# Altium schematic sheet PMIC_RK808.SchDoc
size A3; SheetNumber: 7; SheetTotal: 7
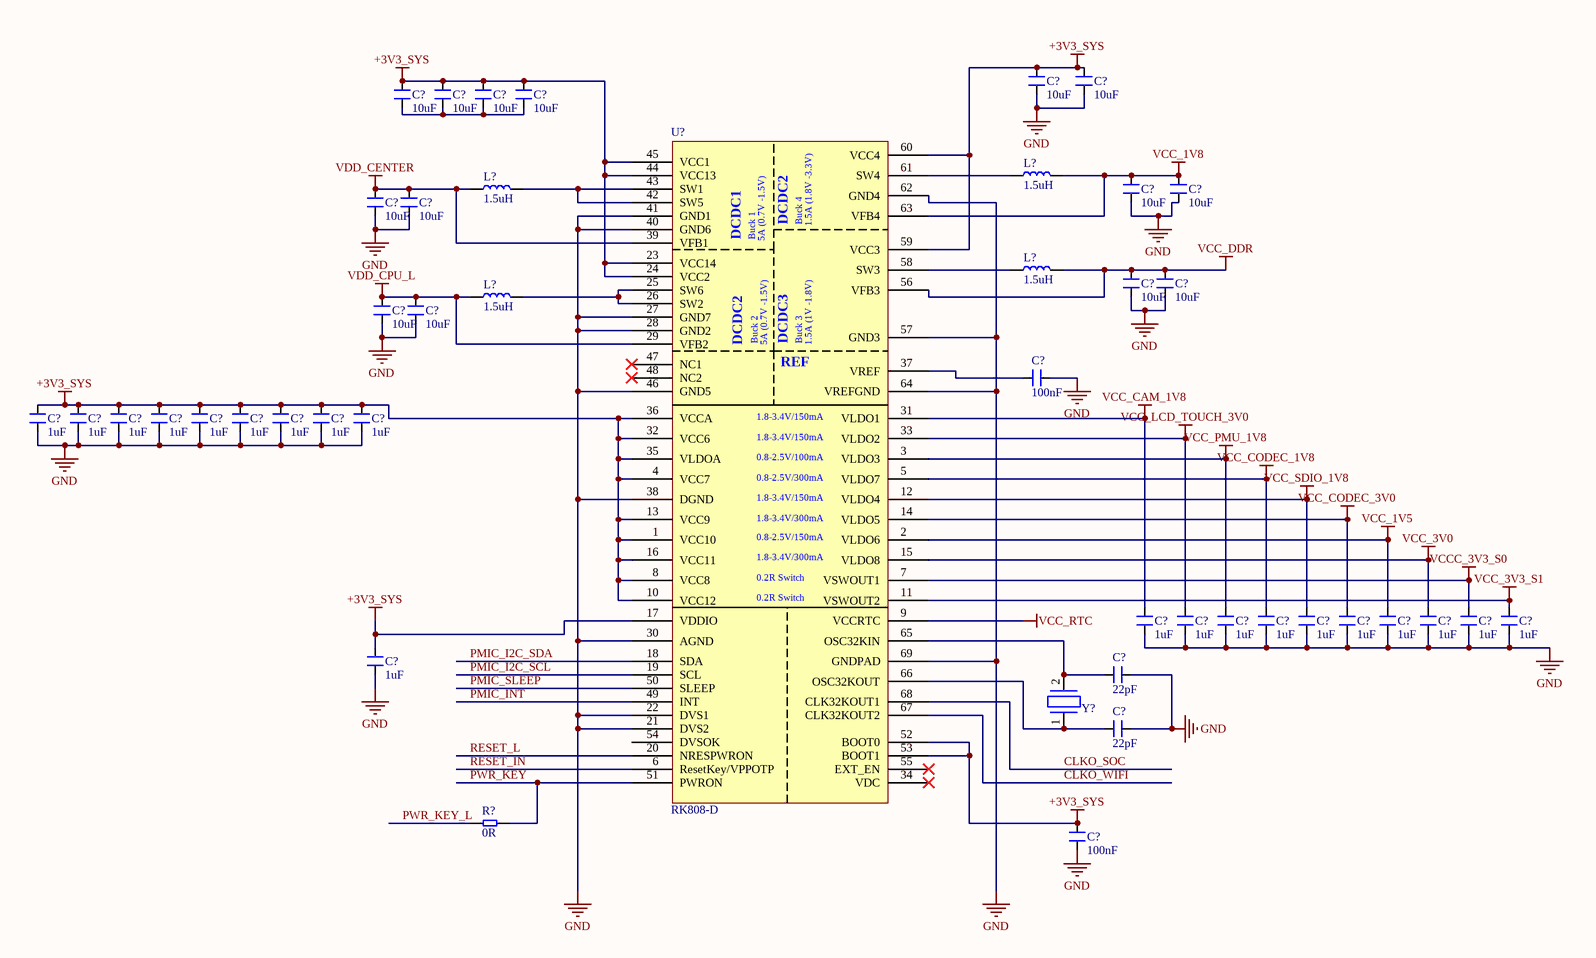
[diagram p0: PMIC_RK808.SchDoc]

## Parts
(Parts that share a designator on the sheet are numbered #1, #2 ... from top to bottom, then left to right.)
C?#1  10uF  [CAP_0402]
C?#2  10uF  [CAP_0402]
C?#3  10uF  [CAP_0402]
C?#4  10uF  [CAP_0402]
C?#5  10uF  [CAP_0402]
C?#6  10uF  [CAP_0402]
C?#7  10uF  [CAP_0402]
C?#8  10uF  [CAP_0402]
C?#9  10uF  [CAP_0402]
C?#10  10uF  [CAP_0402]
C?#11  10uF  [CAP_0402]
C?#12  10uF  [CAP_0402]
C?#13  10uF  [CAP_0402]
C?#14  10uF  [CAP_0402]
C?#15  100nF  [CAP_0201]
C?#16  1uF  [CAP_0201]
C?#17  1uF  [CAP_0201]
C?#18  1uF  [CAP_0201]
C?#19  1uF  [CAP_0201]
C?#20  1uF  [CAP_0201]
C?#21  1uF  [CAP_0201]
C?#22  1uF  [CAP_0201]
C?#23  1uF  [CAP_0201]
C?#24  1uF  [CAP_0201]
C?#25  1uF  [CAP_0201]
C?#26  1uF  [CAP_0201]
C?#27  1uF  [CAP_0201]
C?#28  1uF  [CAP_0201]
C?#29  1uF  [CAP_0201]
C?#30  1uF  [CAP_0201]
C?#31  1uF  [CAP_0201]
C?#32  1uF  [CAP_0201]
C?#33  1uF  [CAP_0201]
C?#34  1uF  [CAP_0201]
C?#35  1uF  [CAP_0201]
C?#36  22pF  [CAP_0201]
C?#37  22pF  [CAP_0201]
C?#38  100nF  [CAP_0201]
L?#1  1.5uH
L?#2  1.5uH
L?#3  1.5uH
L?#4  1.5uH
R?  0R  [RES_0201]
U?  RK808-D  [QFN68_13.7_220.4X220.4_SMD]
Y?  32KHz  (value not drawn)

## Nets
+3V3_SYS: C?#1.2 C?#2.2 C?#3.2 C?#4.2 C?#5.2 C?#6.2 C?#16.2 C?#17.2 C?#18.2 C?#19.2 C?#20.2 C?#21.2 C?#22.2 C?#23.2 C?#24.2 C?#35.2 C?#38.2 U?.1(VCC10) U?.4(VCC7) U?.8(VCC8) U?.10(VCC12) U?.13(VCC9) U?.16(VCC11) U?.17(VDDIO) U?.23(VCC14) U?.24(VCC2) U?.32(VCC6) U?.35(VLDOA) U?.36(VCCA) U?.44(VCC13) U?.45(VCC1) U?.52(BOOT0) U?.53(BOOT1) U?.59(VCC3) U?.60(VCC4)
GND: C?#1.1 C?#2.1 C?#7.1 C?#8.1 C?#9.1 C?#10.1 C?#11.1 C?#12.1 C?#13.1 C?#14.1 C?#15.1 C?#16.1 C?#17.1 C?#18.1 C?#19.1 C?#20.1 C?#21.1 C?#22.1 C?#23.1 C?#24.1 C?#25.1 C?#26.1 C?#27.1 C?#28.1 C?#29.1 C?#30.1 C?#31.1 C?#32.1 C?#33.1 C?#34.1 C?#35.1 C?#36.1 C?#37.1 C?#38.1 U?.21(DVS2) U?.22(DVS1) U?.27(GND7) U?.28(GND2) U?.30(AGND) U?.38(DGND) U?.40(GND6) U?.41(GND1) U?.46(GND5) U?.57(GND3) U?.62(GND4) U?.64(VREFGND) U?.69(GNDPAD)
VCC_1V5: C?#31.2 U?.2(VLDO6)
VCC_1V8: C?#7.2 C?#8.2 L?#1.2 U?.63(VFB4)
VCC_3V0: C?#32.2 U?.15(VLDO8)
VCC_3V3_S1: C?#34.2 U?.11(VSWOUT2)
VCC_CAM_1V8: C?#25.2 U?.31(VLDO1)
VCC_CODEC_1V8: C?#28.2 U?.5(VLDO7)
VCC_CODEC_3V0: C?#30.2 U?.14(VLDO5)
VCC_DDR: C?#11.2 C?#12.2 L?#3.2 U?.56(VFB3)
VCC_LCD_TOUCH_3V0: C?#26.2 U?.33(VLDO2)
VCC_PMU_1V8: C?#27.2 U?.3(VLDO3)
VCC_RTC: U?.9(VCCRTC)
VCC_SDIO_1V8: C?#29.2 U?.12(VLDO4)
VCCC_3V3_S0: C?#33.2 U?.7(VSWOUT1)
VDD_CENTER: C?#9.2 C?#10.2 L?#2.1 U?.39(VFB1)
VDD_CPU_L: C?#13.2 C?#14.2 L?#4.1 U?.29(VFB2)
CLKO_SOC: U?.68(CLK32KOUT1)
CLKO_WIFI: U?.67(CLK32KOUT2)
PMIC_I2C_SCL: U?.19(SCL)
PMIC_I2C_SDA: U?.18(SDA)
PMIC_INT: U?.49(INT)
PMIC_SLEEP: U?.50(SLEEP)
PWR_KEY: R?.2 U?.51(PWRON)
PWR_KEY_L: R?.1
RESET_IN: U?.6(ResetKey/VPPOTP)
RESET_L: U?.20(NRESPWRON)
NetC?#3_1: C?#3.1 C?#4.1 C?#5.1 C?#6.1
NetC?#15_2: C?#15.2 U?.37(VREF)
NetC?#36_2: C?#36.2 U?.65(OSC32KIN) Y?.2
NetC?#37_2: C?#37.2 U?.66(OSC32KOUT) Y?.1
NetL?#1_1: L?#1.1 U?.61(SW4)
NetL?#2_2: L?#2.2 U?.42(SW5) U?.43(SW1)
NetL?#3_1: L?#3.1 U?.58(SW3)
NetL?#4_2: L?#4.2 U?.25(SW6) U?.26(SW2)

Not connected (* = marked no-connect by the designer): U? 34(VDC)* 47(NC1)* 48(NC2)* 54(DVSOK) 55(EXT_EN)*

## Notes on the sheet
- (in symbol IC_RK808-D-QFN68) DCDC2; Buck 4; 1.5A (1.8V -3.3V); DCDC1; Buck 1; 5A (0.7V -1.5V); Buck 2; DCDC3; Buck 3; 1.5A (1V -1.8V); REF; 1.8-3.4V/150mA; 0.8-2.5V/100mA; 0.8-2.5V/300mA; 1.8-3.4V/300mA; 0.8-2.5V/150mA; 0.2R Switch

## Library data of the parts
C?#1-C?#14 = CAP_10uF-10V-20%-0402: Multilayer Ceramic Capacitor, 10 uF, 10 V, ± 20%, X5R, 0402 [1005 Metric]; Manufacturer Part Number: CL05A106MP5NUNC; Manufacturer: Samsung Electro-Mechanics; Manufacturer 1: Samsung; Voltage Rating: 10V; Case/Package: 0402; Supplier-1: Digikey; Supplier 1: Digi-Key; Manufacturer Part Number 1: CL05A106MP5NUNC; RoHS: Yes; Category: Ceramic Capacitors; Stock 1: 2175928; Pricing 1: 1=0.18, 10=0.121, 50=0.0726, 100=0.0613, 500=0.04192, 1000=0.03708, 2500=0.03546, 5000=0.03224 (USD); Mount: Surface Mount; Case Code (Metric): 1005; Case Code (Imperial): 0402; Min Operating Temperature: -55°C; Max Operating Temperature: 85°C; Package Quantity: 1; Packaging: Tape and Reel; Capacitance: 10uF; Tolerance: 20%; Dielectric: X5R; Series: CL; Length: 1mm; Width: 0.02inch; Thickness: 0.028inch; Depth: 0.5mm; Radiation Hardening: No; Lead Free: Lead Free; RoHS Compliant: Yes; ComponentLink1URL: https://datasheet.ciiva.com/25721/cl05a106mp5nunc-25721584.pdf?src-supplier=Digi-Key; ComponentLink1Description: https://datasheet.ciiva.com/25721/cl05a106mp5nunc-25721584.pdf?src-supplier=Digi-Key; ComponentLink2URL: https://datasheet.ciiva.com/26838/getdatasheetpartid-745310-26838170.pdf?src-supplier=Verical; ComponentLink2Description: https://datasheet.ciiva.com/26838/getdatasheetpartid-745310-26838170.pdf?src-supplier=Verical; Supplier Part Number 1: 1276-1450-1-ND
C?#15 C?#38 = CAP_100nF-25V-10%-0201: Multilayer Ceramic Capacitor, 0.1 uF, 25 V, ± 10%, X5R, 0201 [0603 Metric]; Manufacturer: TDK Corporation; Manufacturer Part Number: C0603X5R1E104K030BB; Manufacturer 1: TDK; Voltage Rating: 25V; Case/Package: 0201; Supplier-1: Digikey; Supplier 1: Digi-Key; Manufacturer Part Number 1: C0603X5R1E104K030BB; RoHS: Yes; Category: Ceramic Capacitors; Stock 1: 525939; Pricing 1: 1=0.1, 10=0.069, 50=0.0376, 100=0.0307, 500=0.02192, 1000=0.01722, 2500=0.01566, 5000=0.0144 (USD); Mount: Surface Mount; Case Code (Metric): 0603; Case Code (Imperial): 0201; Weight: 6E-06oz; Dielectric Material: Ceramic; Min Operating Temperature: -55°C; Max Operating Temperature: 85°C; Package Quantity: 15000; Packaging: Tape and Reel; Capacitance: 100nF; Tolerance: 10%; Dielectric: X5R; Termination: SMD/SMT; Voltage Rating (DC): 25V; Series: C; Length: 0.6mm; Width: 0.3mm; Height: 0.3mm; Depth: 0.3mm; Reach SVHC Compliant: No; Lead Free: Lead Free; RoHS Compliant: Yes; ComponentLink1URL: https://datasheet.ciiva.com/14915/tdkmlcccaprange-14915358.pdf?src-supplier=Digi-Key; ComponentLink1Description: https://datasheet.ciiva.com/14915/tdkmlcccaprange-14915358.pdf?src-supplier=Digi-Key; Supplier Part Number 1: 445-13671-1-ND
C?#16-C?#35 = CAP_1uF-16V-10%-0201: Multilayer Ceramic Capacitor, 1 uF, 16 V, ± 20%, X5R, 0201 [0603 Metric]; Manufacturer: Samsung Electro-Mechanics; Manufacturer Part Number: CL03A105MO3NRNH; Manufacturer 1: Samsung; Case/Package: 0201; Supplier-1: Digikey; Supplier 1: Digi-Key; Manufacturer Part Number 1: CL03A105MO3NRNH; RoHS: Yes; Category: Ceramic Capacitors; Stock 1: 1186098; Pricing 1: 1=0.25, 10=0.17, 50=0.1018, 100=0.086, 500=0.05882, 1000=0.05204, 2500=0.04977, 5000=0.04525 (USD); ComponentLink1URL: https://datasheet.octopart.com/CL03A105MO3NRNH-Samsung-Electro-Mechanics-datasheet-136037157.pdf?src-supplier=Future+Electronics; ComponentLink1Description: https://datasheet.octopart.com/CL03A105MO3NRNH-Samsung-Electro-Mechanics-datasheet-136037157.pdf?src-supplier=Future+Electronics; ComponentLink2URL: http://www.samsungsem.com/kr/support/product-search/mlcc/CL03A105MO3NRNH.jsp?src-supplier=Digi-Key; ComponentLink2Description: http://www.samsungsem.com/kr/support/product-search/mlcc/CL03A105MO3NRNH.jsp?src-supplier=Digi-Key
C?#36 C?#37 = CAP_22pF-25V-10%-0201: Cap Ceramic 22pF 25V C0G 10% SMD 0201 125C Paper T/R; Manufacturer: Johanson Technology Inc.; Manufacturer Part Number: 250R05L220KV4T; Manufacturer 1: Johanson; Case/Package: 0201; Supplier-1: Digikey; Supplier 1: Mouser; Manufacturer Part Number 1: 250R05L220KV4T; RoHS: Yes; Category: Ceramic Capacitors; Pricing 1: 1=0.11, 10=0.081, 50=0.081, 100=0.037, 1000=0.021, 10000=0.015 (USD); Mount: Surface Mount; Case Code (Imperial): 0201; Case Code (Metric): 0603; Weight: 6E-06oz; Min Operating Temperature: -55°C; Max Operating Temperature: 125°C; Voltage Rating: 25V; Capacitance: 22pF; Voltage Rating (DC): 25V; Tolerance: 10%; Packaging: Tape and Reel; Package Quantity: 15000; Dielectric: C0G; Termination: SMD/SMT; Series: L; Length: 0.6mm; Width: 0.3mm; Height: 0.3mm; Depth: 0.3mm; RoHS Compliant: Yes; ComponentLink1URL: http://www.mouser.com/ds/2/611/JTI-CAT-MLCC-HighQ-516212.pdf?src-supplier=Mouser; ComponentLink1Description: http://www.mouser.com/ds/2/611/JTI-CAT-MLCC-HighQ-516212.pdf?src-supplier=Mouser; ComponentLink2URL: https://www.johansontechnology.com/downloads/JTI-CAT-MLCC-HighQ.pdf?src-supplier=Digi-Key; ComponentLink2Description: https://www.johansontechnology.com/downloads/JTI-CAT-MLCC-HighQ.pdf?src-supplier=Digi-Key; ComponentLink3URL: http://components.arrow.com/part/dataview/43745096S9156427N2069?src-supplier=Arrow+Electronics; ComponentLink3Description: http://components.arrow.com/part/dataview/43745096S9156427N2069?src-supplier=Arrow+Electronics; Supplier Part Number 1: 609-250R05L220KV4T
L?#1-L?#4 = IND_1.5uH-6A-20%-SMD: WPN4020H1R5MT / Wire Wound SMD Power Inductors – WPN Series / Operating Temp. : -40℃~+125℃ (Including self-heating) /; Manufacturer: Sunlord; Mnaufcaturer Part Number: WPN4020H1R5MT; Case/Package: SMD; Supplier-1: NA
R? = RES_0R-0.05W-1%-0201: 0 Ohms Jumper 0.05W, 1/20W Chip Resistor 0201 (0603 Metric) Automotive AEC-Q200 Thick Film; Manufacturer: Bourns Inc.; Manufacturer Part Number: CR0201AJ/-000GLF; Case/Package: 0201; Supplier-1: Digikey
U? = IC_RK808-D-QFN68: The RK808 is a complete power supply solution for Portable systems.; Manufacturer: Rockchip; Manufacturer Part Number: RK808-D; Case/Package: QFN68; Supplier-1: Rockchip
Y? = XTAL_32MHz_ABS07-32.768KHZ-T: Crystal 0.032768MHz ±20ppm (Tol) 12.5pF Flexural 70000Ohm 2-Pin CSMD T/R; Manufacturer: Abracon; ESR (Equivalent Series Resistance): 70kR; Supplier 1: Future Electronics; Manufacturer Part Number: ABS07-32.768KHZ-T; RoHS: Yes; Category: Crystals; Stock 1: 461; Pricing 1: 1=0.675, 15=0.585, 75=0.53, 300=0.48, 1500=0.425 (USD); Case/Package: CSMD; Number of Pins: 2; Min Operating Temperature: -40°C; Max Operating Temperature: 85°C; Frequency Tolerance: 20ppm; Load Capacitance: 12.5pF; Frequency: 32.768kHz; Packaging: Tape and Reel; Series: ABS07; Operating Frequency: 32.768 kHz; Package Quantity: 3000; Tolerance: 20ppm; Termination: SMD/SMT; Series Resistance: 70kR; Length: 3.2mm; Width: 1.5mm; Height: 0.9mm; Depth: 1.5mm; Radiation Hardening: No; Lead Free: Lead Free; RoHS Compliant: Yes; Reach SVHC Compliant: No; ComponentLink1URL: https://datasheet.ciiva.com/7998/1912628-7998667.pdf?src-supplier=Element14; ComponentLink1Description: https://datasheet.ciiva.com/7998/1912628-7998667.pdf?src-supplier=Element14; ComponentLink2URL: https://datasheet.ciiva.com/1357/1883680-1357319.pdf?src-supplier=Element14; ComponentLink2Description: https://datasheet.ciiva.com/1357/1883680-1357319.pdf?src-supplier=Element14; ComponentLink3URL: https://datasheet.ciiva.com/854/abs07-854936.pdf?src-supplier=Digi-Key; ComponentLink3Description: https://datasheet.ciiva.com/854/abs07-854936.pdf?src-supplier=Digi-Key; ComponentLink4URL: https://datasheet.ciiva.com/854/abs07-854935.pdf?src-supplier=Digi-Key; ComponentLink4Description: https://datasheet.ciiva.com/854/abs07-854935.pdf?src-supplier=Digi-Key; ComponentLink5URL: https://datasheet.ciiva.com/854/abs07-854937.pdf?src-supplier=Digi-Key; ComponentLink5Description: https://datasheet.ciiva.com/854/abs07-854937.pdf?src-supplier=Digi-Key; ComponentLink6URL: https://datasheet.ciiva.com/4944/abs07-11028-4944830.pdf?src-supplier=Mouser; ComponentLink6Description: https://datasheet.ciiva.com/4944/abs07-11028-4944830.pdf?src-supplier=Mouser; ComponentLink7URL: https://datasheet.ciiva.com/15214/getdatasheetpartid-727011-15214954.pdf?src-supplier=Verical; ComponentLink7Description: https://datasheet.ciiva.com/15214/getdatasheetpartid-727011-15214954.pdf?src-supplier=Verical